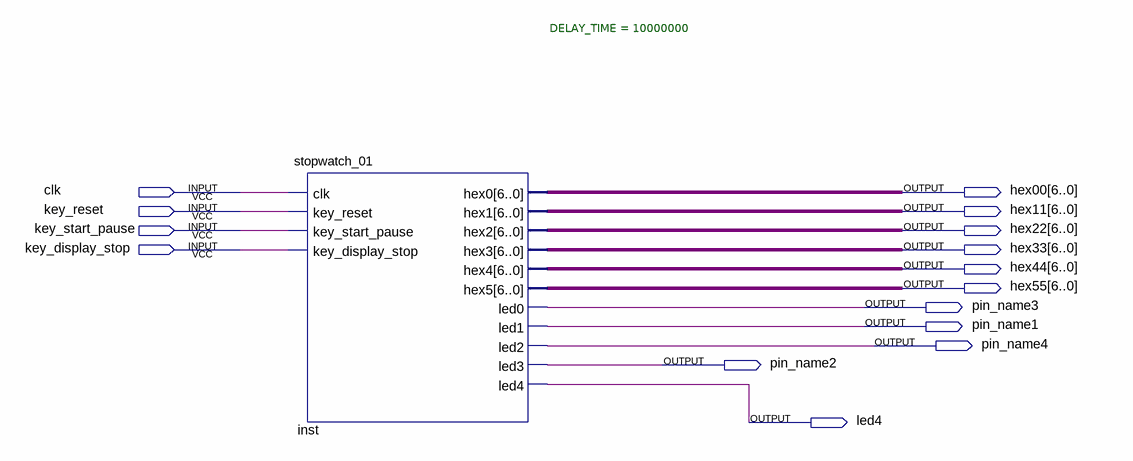
[diagram p0: schematic sheet]
// Quartus schematic clock.bdf as structural Verilog: 1 symbols, 15 pins
module clock (
  input  clk,
  input  key_reset,
  input  key_start_pause,
  input  key_display_stop,
  output [6:0] hex00,
  output [6:0] hex11,
  output [6:0] hex22,
  output [6:0] hex33,
  output [6:0] hex44,
  output [6:0] hex55,
  output pin_name3,
  output pin_name1,
  output pin_name4,
  output pin_name2,
  output led4
);

  stopwatch_01 #(.DELAY_TIME(10000000)) inst (
    .clk(clk), .key_reset(key_reset), .key_start_pause(key_start_pause), .key_display_stop(key_display_stop),
    .hex0(hex00), .hex1(hex11), .hex2(hex22), .hex3(hex33), .hex4(hex44), .hex5(hex55), .led0(pin_name3),
    .led1(pin_name1), .led2(pin_name4), .led3(pin_name2), .led4(led4));
endmodule
